# EAGLE design czujniki (EAGLE 7.3.0)
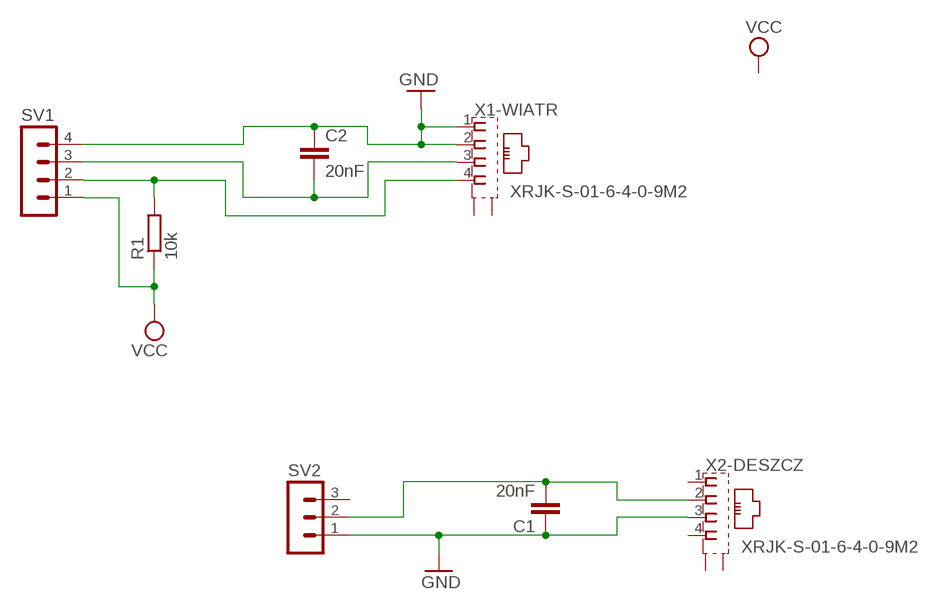
[diagram p0: schematic, sheet 1]

## Parts
C1  20nF  C2.5/2  [C2.5-2]
C2  20nF  C2.5/2  [C2.5-2]
R1  10k  R-EU_M1206  [M1206]
SV1  MA04-1  [MA04-1]
SV2  MA03-1  [MA03-1]
X1-WIATR  XRJK-S-01-6-4-0-9M2  [XRJK-S-01-6-4-0-9M2]
X2-DESZCZ  XRJK-S-01-6-4-0-9M2  [XRJK-S-01-6-4-0-9M2]

## Nets
GND: C1.1 C2.1 SV1.4 SV2.1 X1-WIATR.1 X1-WIATR.2 X2-DESZCZ.3
N$2: C1.2 SV2.2 X2-DESZCZ.2
N$3: C2.2 SV1.3 X1-WIATR.3
N$5: R1.2 SV1.2 X1-WIATR.4
VCC: R1.1 SV1.1
Unconnected: SV2.3 X1-WIATR.S1(S) X1-WIATR.S2(S) X2-DESZCZ.1 X2-DESZCZ.4 X2-DESZCZ.S1(S) X2-DESZCZ.S2(S)

## Library data of the parts
C1 C2 = capacitor-wima:C: CAPACITOR naming: grid - package width
R1 = rcl:R-EU_: RESISTOR, European symbol
SV1 = con-lstb:MA04-1: PIN HEADER; OC_FARNELL: unknown; OC_NEWARK: unknown
SV2 = con-lstb:MA03-1: PIN HEADER; OC_FARNELL: unknown; OC_NEWARK: unknown
X1-WIATR X2-DESZCZ = con-xmultiple:XRJK*4: RJ11 Connector without LED, 6 position, 4 contacts, thrue hole Source: XRJK-S-01-6-4-0-9M2(01).pdf

## Board
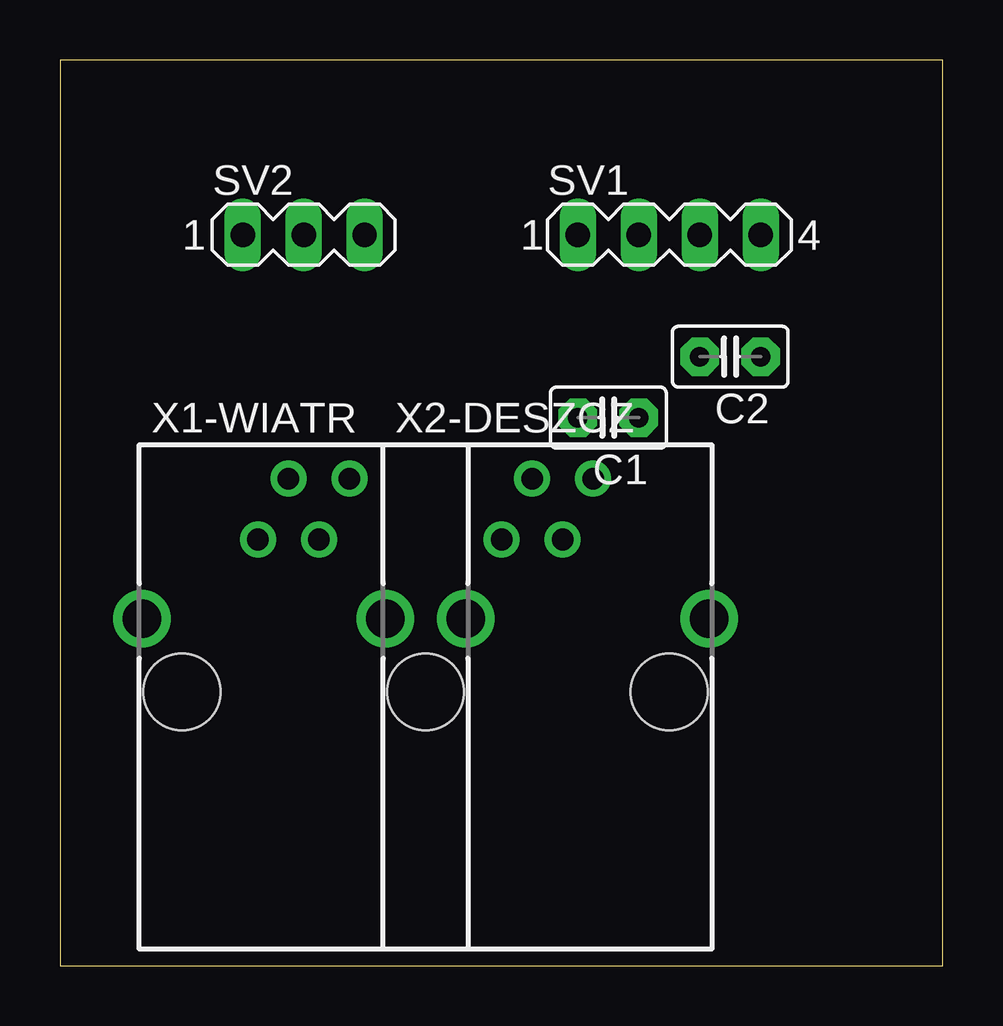
[diagram p1: board, top side]
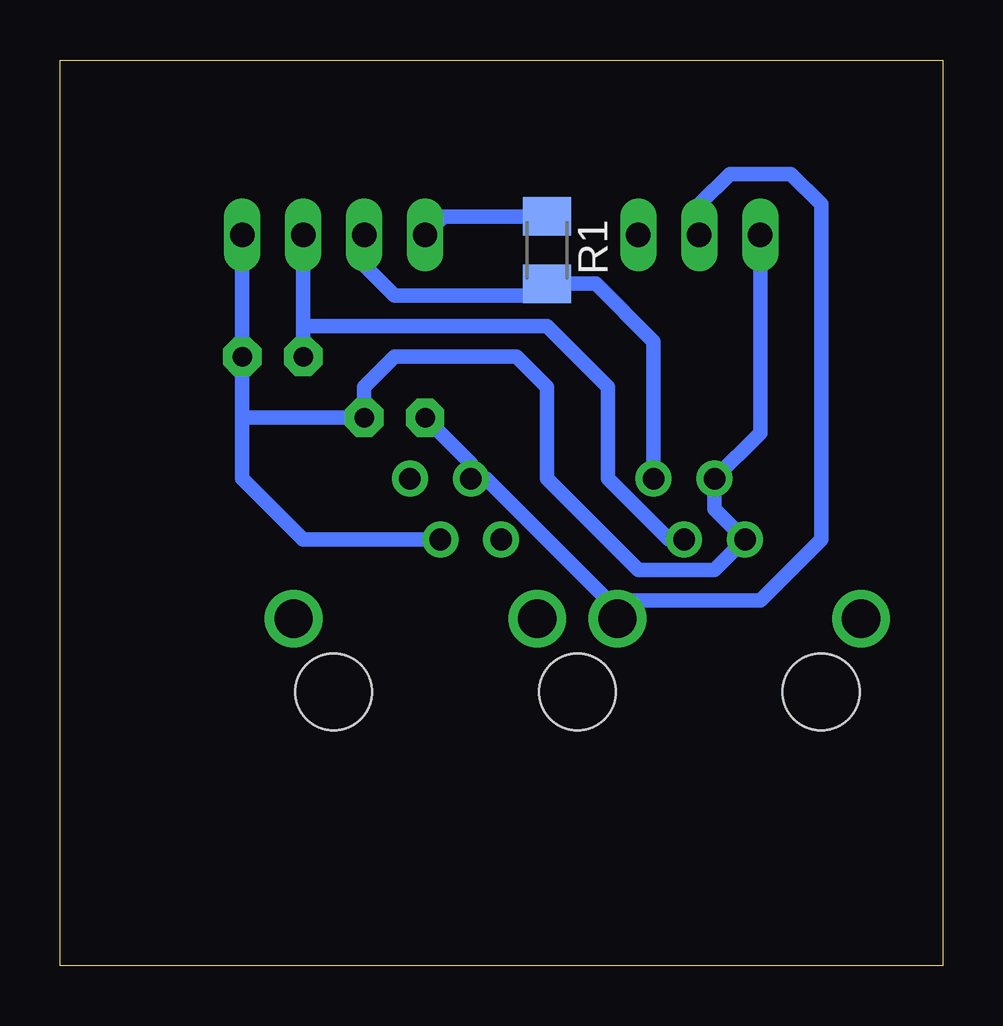
[diagram p2: board, bottom side, seen from below]

Size 36.81 x 37.77 mm. Coordinates in mm from the lower left corner, seen from the top.
Outline: 0,0 36.81,0 36.81,37.77 0,37.77 0,0
Copper layers (1*16): Top 0.035mm / dielectric 1.5mm / Bottom 0.035mm
Design rules "default": minimum track width 10mil, minimum drill 24mil, track to track 8mil, track to pad 8mil, pad to pad 8mil, via to via 8mil, smd to smd 8mil, copper to edge 40mil, drill to drill 8mil, minimum pad ring 10mil, minimum via ring 8mil, stop-mask expansion 4mil, vias tented up to drill 0mil, thermal gap 10mil

### Footprints (pad centres in the part's own frame; a part is rotated, then mirrored left to right if it is on the bottom)
C2.5-2 = drill 0.813 pad 1.6 octagon: 1 -1.27,0; 2 1.27,0
M1206 = smd 1.6 x 2: 1 -1.4,0; 2 1.4,0
MA04-1 = drill 1.016 long: 1 -3.81,0; 2 -1.27,0; 3 1.27,0; 4 3.81,0
MA03-1 = drill 1.016 long: 1 -2.54,0; 2 0,0; 3 2.54,0
XRJK-S-01-6-4-0-9M2 = drill 0.9 pad 1.5: 1 -1.905,6.35; 2 -0.635,8.89; 3 0.635,6.35; 4 1.905,8.89 | drill 1.6 pad 2.184: S1 -6.75,3.05; S2 6.75,3.05 | hole 3.2: -5.08,0; 5.08,0

### Placement (x,y rotation side)
C1  22.86,22.86 180 top
C2  27.94,25.4 180 top
R1  16.51,29.84 270 bottom
SV1  25.4,30.48 0 top
SV2  10.16,30.48 0 top
X1-WIATR  10.16,11.43 0 top
X2-DESZCZ  20.32,11.43 0 top

### Tracks (layer width: path | path; a pad name or v marks a point on that pad's centre or on a via)
GND
  Bottom 0.61: SV2.1 7.62,22.23 X1-WIATR.2 9.53,19.05 X1-WIATR.1 9.53,16.51 12.7,16.51 16.51,20.32 16.51,24.13 17.78,25.4 22.86,25.4 24.13,24.13 C1.1 29.21,22.86 | X2-DESZCZ.3 26.67,17.78 29.21,20.32 29.21,22.86 | SV1.4 C2.1 29.21,22.86
N$2
  Bottom 0.61: SV2.2 10.16,31.75 8.89,33.02 6.35,33.02 5.08,31.75 5.08,17.78 7.62,15.24 13.97,15.24 19.05,20.32 X2-DESZCZ.2 19.68,20.95 C1.2
N$3
  Bottom 0.61: SV1.3 26.67,26.67 | 26.67,26.67 C2.2 | X1-WIATR.3 11.43,17.78 13.97,20.32 13.97,24.13 16.51,26.67 26.67,26.67
N$5
  Bottom 0.61: X1-WIATR.4 12.06,26.04 14.47,28.45 R1.2 17.02,27.94 22.86,27.94 24.13,29.21 SV1.2
VCC
  Bottom 0.61: R1.1 20.82,31.25 SV1.1